# EAGLE design Zoetrope (EAGLE 8.6.0)
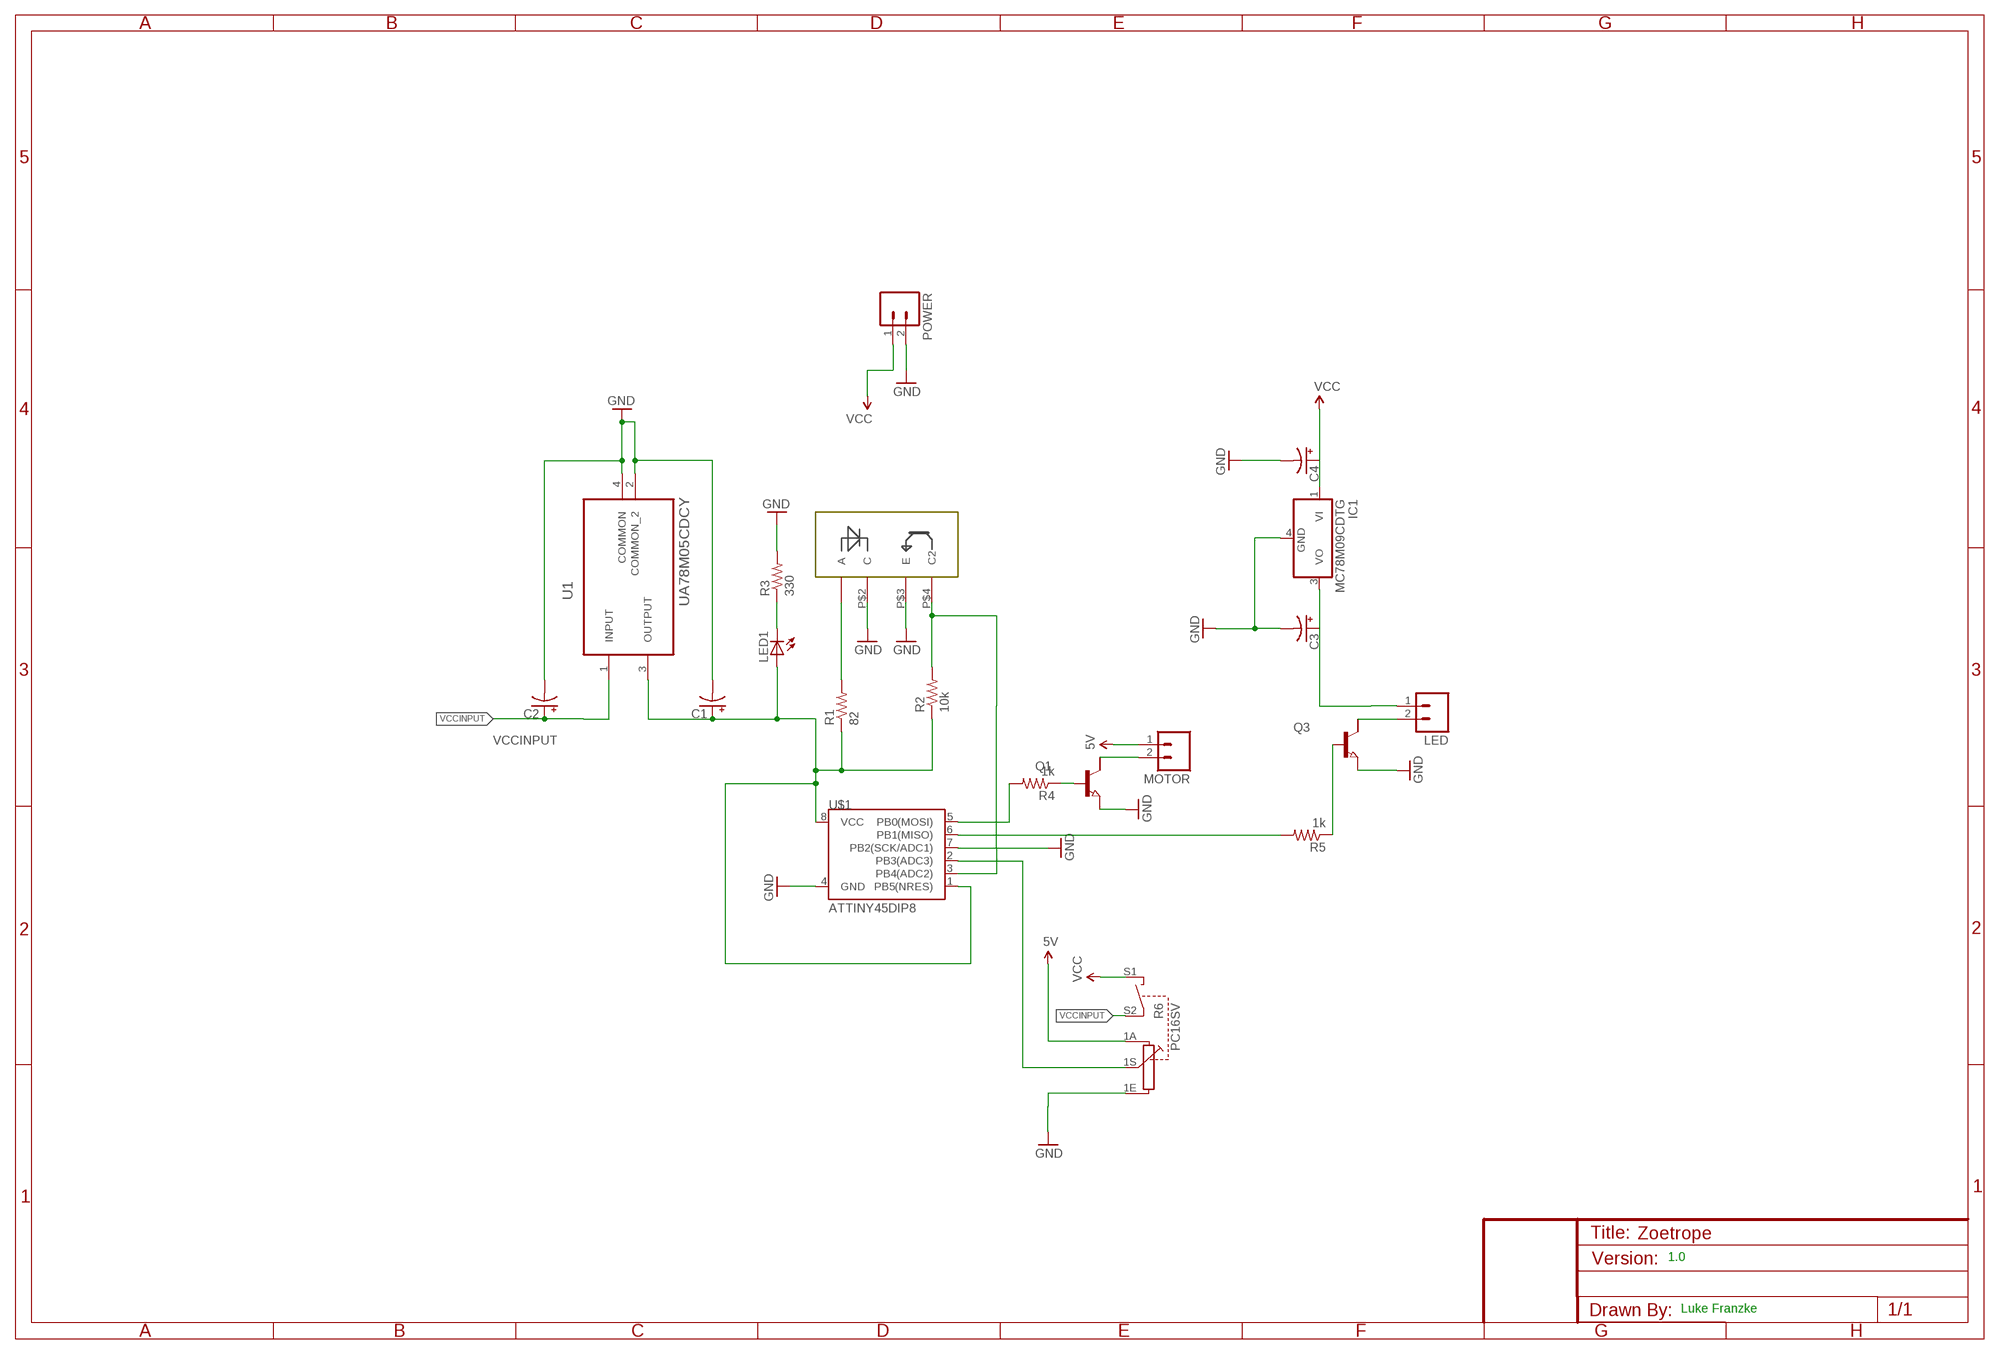
[diagram p0: schematic, sheet 1]

## Parts
C1  CAP_POL1206  [EIA3216]
C2  CAP_POL1206  [EIA3216]
C3  CAP_POL1206  [EIA3216]
C4  CAP_POL1206  [EIA3216]
IC1  MC78M09CDTG  [DPACK_3]
LED  M02  [02P]
LED1  LED1206  [LED-1206]
MOTOR  M02  [02P]
POWER  M02  [02P]
Q1  NPN-TRANSISTIOR-2COLSOT89  [SOT89]
Q3  NPN-TRANSISTIOR-2COLSOT89  [SOT89]
R1  82  RESISTOR1206  [1206]
R2  10k  RESISTOR1206  [1206]
R3  330  RESISTOR1206  [1206]
R4  1k  RESISTOR1206  [1206]
R5  1k  RESISTOR1206  [1206]
R6  PC16SV  [PC16SV]
U1  UA78M05CDCY  [SOT230P700X180-4N]
U$1  ATTINY45DIP8  [DIP08]
U$2  TCRT1000  [TCRT1000]

## Nets
5V: C1.A(+) LED1.A MOTOR.1 R1.1 R2.1 R6.1A U1.3(OUTPUT) U$1.1(PB5(NRES)) U$1.8(VCC)
GND: C1.C(-) C2.C(-) C3.C(-) C4.C(-) IC1.4(GND) POWER.2 Q1.3(E) Q3.3(E) R3.2 R6.1E U1.2(COMMON_2) U1.4(COMMON) U$1.4(GND) U$1.7(PB2(SCK/ADC1)) U$2.P$2(C) U$2.P$3(E)
N$1: R5.2 U$1.6(PB1(MISO))
N$2: LED1.C R3.1
N$3: LED.2 Q3.2(C)
N$4: R1.2 U$2.P$1(A)
N$5: R2.2 U$1.3(PB4(ADC2)) U$2.P$4(C2)
N$6: R6.1S U$1.2(PB3(ADC3))
N$7: Q3.1(B) R5.1
N$8: Q1.1(B) R4.1
N$9: R4.2 U$1.5(PB0(MOSI))
N$10: MOTOR.2 Q1.2(C)
N$12: C3.A(+) IC1.3(VO) LED.1
VCC: C4.A(+) IC1.1(VI) POWER.1 R6.S1
VCCINPUT: C2.A(+) R6.S2 U1.1(INPUT)
Unconnected: Q1.2@1(C/) Q3.2@1(C/)

## Notes on the sheet
- 1.0
- Luke Franzke

## Library data of the parts
C1-C4 = RP400N501A:CAP_POL: Capacitor Polarized These are standard SMD and PTH capacitors. Normally 10uF, 47uF, and 100uF in electrolytic and tantalum varieties. Always verify the external diameter of the through hole cap, it varies with capacity, voltage, and manufacturer. The EIA devices should be standard.
IC1 = linear:MC78M: 500 mA Positive Voltage Regulators Source: Data sheet <http://www.onsemi.com/pub_link/Collateral/MC78M00-D.PDF>
LED MOTOR POWER = con-amp-quick:M02: AMP QUICK CONNECTOR; OC_FARNELL: unknown; OC_NEWARK: unknown
LED1 = SparkFun:LED: LEDs Standard schematic elements and footprints for 5mm, 3mm, 1206, and 0603 sized LEDs. 5mm - Spark Fun Electronics SKU : COM-00529 (and others)
Q1 Q3 = semicon-smd-ipc:NPN-TRANSISTIOR-2COL: NPN TRANSISTOR 2 colletor pins
R1-R5 = SparkFun:RESISTOR: Resistor Basic schematic elements and footprints for 0603, 1206, and PTH 1/10th watt (small) resistors.
R6 = piher:PC16SV: POTENTIOMETER vertical single carbon potentiometer with switch, 16 mm; OC_FARNELL: unknown; OC_NEWARK: unknown
U1 = Texas Instruments_By_element14_Batch_1:UA78M05CDCY: IC, LINEAR VOLT REGULATOR, 5V; MPN: UA78M05CDCY; OC_FARNELL: 1575761; OC_NEWARK: 77C1885; PACKAGE: SOT-223-3; SUPPLIER: TEXAS INSTRUMENTS
U$1 = SparkFun:ATTINY45: Atmel ATTiny45
U$2 = TCRT1000:TCRT1000

## Board
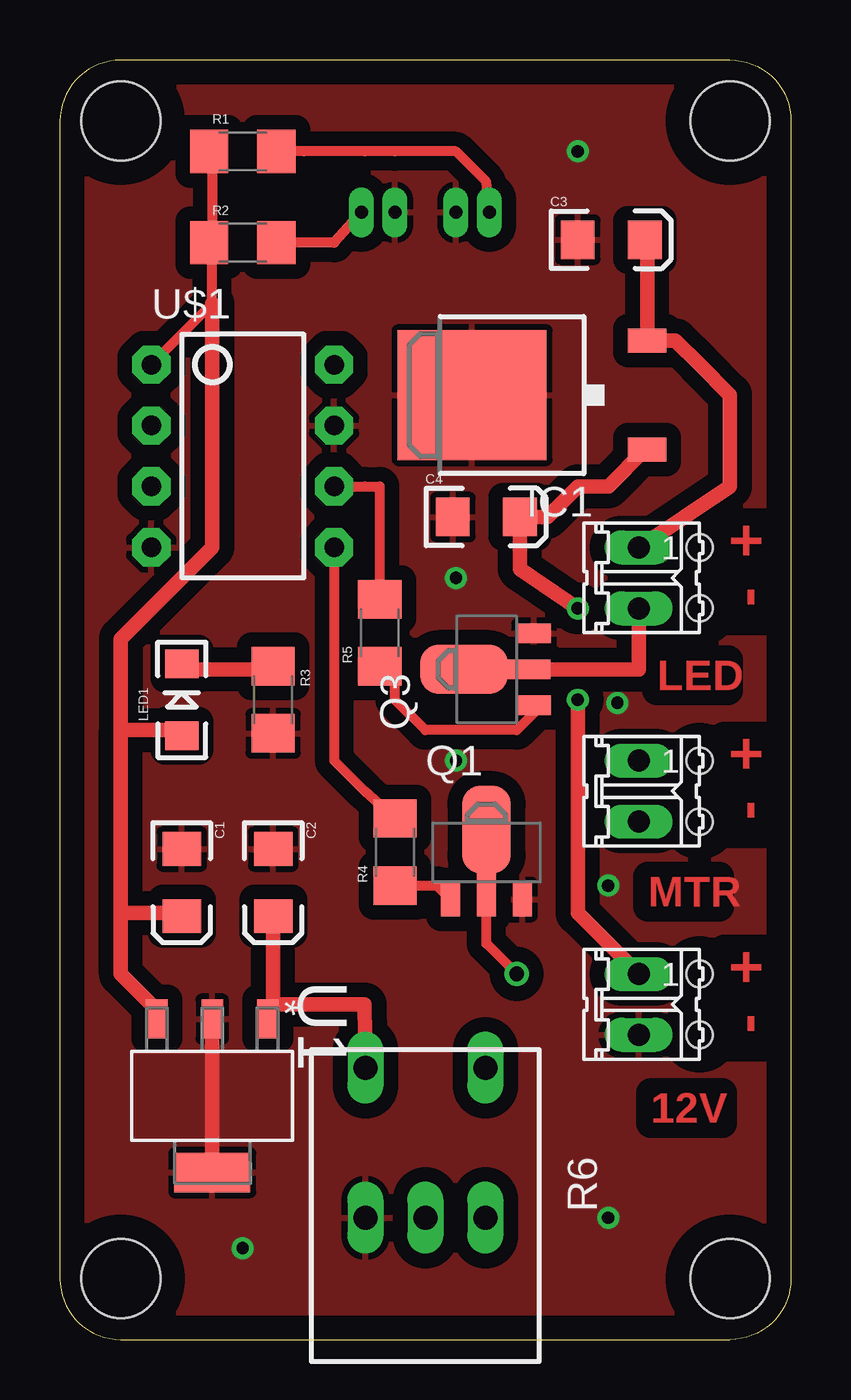
[diagram p1: board, top side]
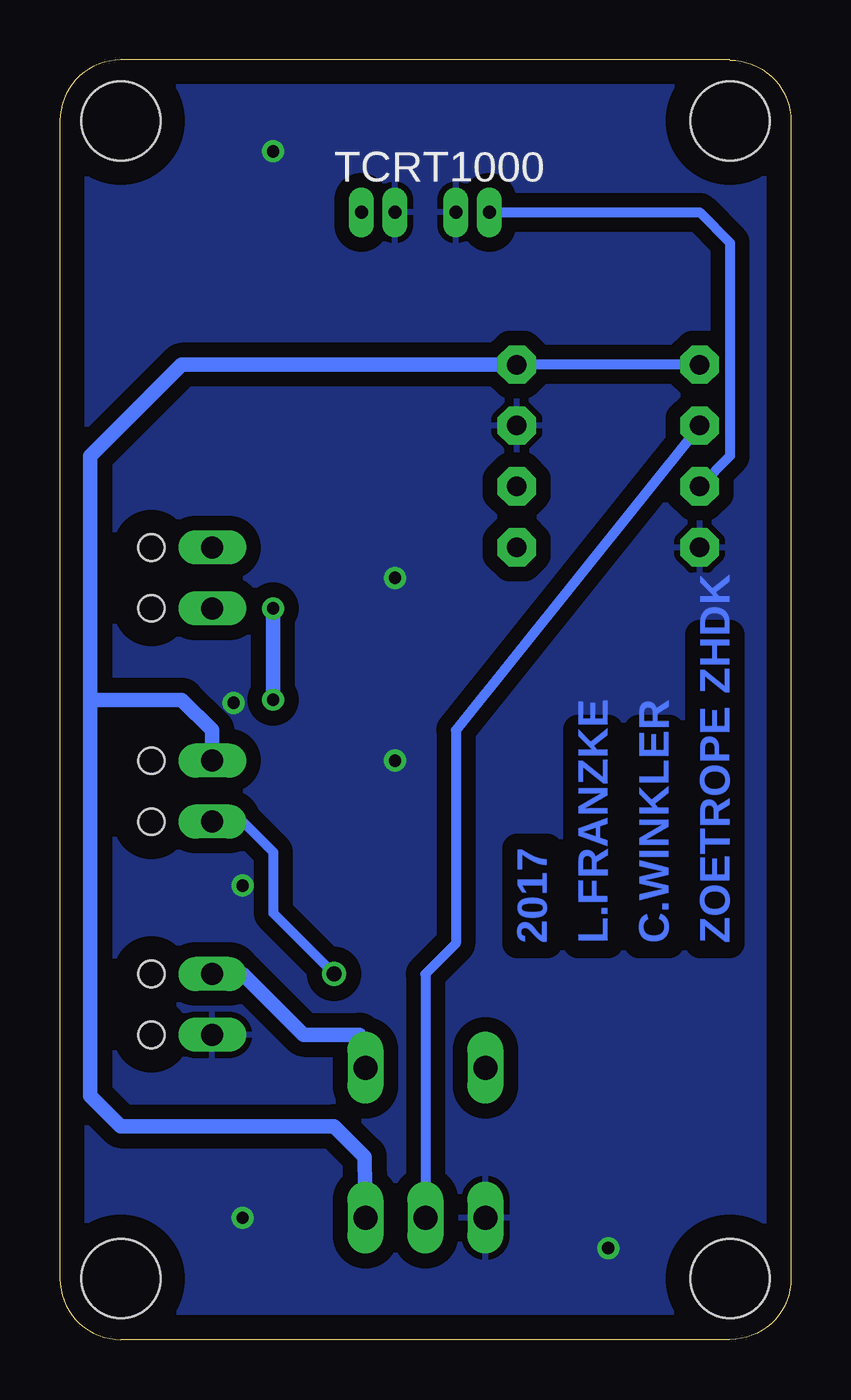
[diagram p2: board, bottom side, seen from below]

Size 30.48 x 53.34 mm. Coordinates in mm from the lower left corner, seen from the top.
Outline: 2.54,53.33 arc90 0,50.79 0,2.54 arc90 2.54,0 27.94,0 arc90 30.48,2.54 30.48,50.8 arc90 27.94,53.34 2.54,53.34
Copper layers (1*16): Top 0.035mm / dielectric 1.5mm / Bottom 0.035mm
Design rules "default": minimum track width 10mil, minimum drill 24mil, track to track 8mil, track to pad 8mil, pad to pad 8mil, via to via 8mil, smd to smd 8mil, copper to edge 40mil, drill to drill 8mil, minimum pad ring 10mil, minimum via ring 8mil, stop-mask expansion 4mil, vias tented up to drill 0mil, thermal gap 10mil

### Footprints (pad centres in the part's own frame; a part is rotated, then mirrored left to right if it is on the bottom)
EIA3216 = smd 1.4 x 1.6: A 1.4,0; C -1.4,0
DPACK_3 = smd 1 x 1.6: 1 -2.28,-4.8; 3 2.28,-4.8 | smd 5.4 x 6.2: 4 0,2.5
02P = drill 0.914 long: 1 -1.27,0; 2 1.27,0 | hole 1.1: -1.27,2.54; 1.27,2.54
LED-1206 = smd 1.2 x 1.4: A -1.5,0; C 1.5,0
SOT89 = smd 0.8 x 1.4: 1 -1.499,-1.981; 3 1.499,-1.981 | smd 0.8 x 1.9: 2 0,-1.727 | smd 2.032 x 3.65: 2@1 0,0.94
1206 = smd 1.6 x 1.8: 1 -1.4,0; 2 1.4,0
PC16SV = drill 1 long: 1A -2.5,0; 1E 2.5,0; 1S 0,0; S1 -2.5,-6.25; S2 2.5,-6.25
SOT230P700X180-4N = smd 1.626 x 0.889: 1 -3.2,2.311; 2 -3.2,0; 3 -3.2,-2.311 | smd 1.626 x 3.175: 4 3.2,0
DIP08 = drill 0.813 pad 1.6 octagon: 1 -3.81,-3.81; 2 -1.27,-3.81; 3 1.27,-3.81; 4 3.81,-3.81; 5 3.81,3.81; 6 1.27,3.81; 7 -1.27,3.81; 8 -3.81,3.81
TCRT1000 = drill 0.533 long: P$1 -2.667,0; P$2 -1.27,0; P$3 1.27,0; P$4 2.667,0
STAND-OFF = hole 3.302: 0,0

### Placement (x,y rotation side)
C1  5.08,19.05 270 top
C2  8.89,19.05 270 top
C3  22.99,45.85 0 top
C4  17.78,34.29 0 top
IC1  19.68,39.37 90 top
LED  24.13,31.75 270 top
LED1  5.08,26.67 90 top
MOTOR  24.13,22.86 270 top
POWER  24.13,13.97 270 top
Q1  17.78,20.32 0 top
Q3  17.78,27.94 90 top
R1  7.62,49.53 0 top
R2  7.62,45.72 0 top
R3  8.89,26.67 270 top
R4  13.97,20.32 90 top
R5  13.34,29.46 90 top
R6  15.24,5.08 180 top
U1  6.35,10.16 270 top
U$1  7.62,36.83 270 top
U$2  15.24,46.99 0 bottom
U$4  [STAND-OFF]  2.54,50.8 0 top
U$5  [STAND-OFF]  27.94,50.8 0 top
U$6  [STAND-OFF]  2.54,2.54 0 top
U$7  [STAND-OFF]  27.94,2.54 0 top

### Tracks (layer width: path | path; a pad name or v marks a point on that pad's centre or on a via)
5V
  Top 0.254: 5.08,25.4 LED1.A | 3.81,13.97 U1.3 | 5.08,17.78 C1.A | 6.35,49.53 R1.1 | 6.35,45.72 R2.1 6.35,45.72
  Top 0.406: 6.35,49.53 6.35,45.72 6.35,43.18 U$1.1
  Top 0.61: 2.54,25.4 5.08,25.4 | 2.54,17.78 2.54,15.24 3.81,13.97 | 2.54,17.78 2.54,25.4 | 2.54,17.78 5.08,17.78 | 2.54,25.4 2.54,29.21 6.35,33.02 6.35,43.18
  Bottom 0.406: U$1.1 U$1.8
  Bottom 0.61: 29.21,26.67 29.21,10.16 27.94,8.89 19.05,8.89 17.78,7.62 R6.1A | MOTOR.1 24.13,25.4 25.4,26.67 29.21,26.67 | U$1.8 25.4,40.64 29.21,36.83 29.21,26.67
GND  (via drill 0.51)
  Top 0.61: U1.2 U1.4
  other vias: 16.51,24.13 22.86,5.08 21.59,49.53 7.62,3.81 16.51,31.75 23.24,26.54 22.86,18.92
  pour Top (isolate 0.61): 31.75,-1.27 31.75,54.61 -1.27,54.61 -1.27,-1.27
  pour Bottom (isolate 0.61): 33.02,-2.54 33.02,55.88 -2.54,55.88 -2.54,-2.54
N$1
  Top 0.406: R5.2 13.34,35.56 12.7,35.56 U$1.6
N$2
  Top 0.254: 5.08,27.94 LED1.C | 8.89,27.94 R3.1
  Top 0.61: 8.89,27.94 5.08,27.94
N$3
  Top 0.61: Q3.2 24.13,27.94 24.13,29.21 LED.2
N$4
  Top 0.254: R1.2 10.16,49.53 R1.2
  Top 0.406: R1.2 10.16,49.53 12.7,49.53 13.97,49.53 16.51,49.53 17.78,48.26 U$2.P$1
N$5
  Top 0.254: R2.2 8.89,45.72 R2.2
  Top 0.406: R2.2 11.43,45.72 U$2.P$4
  Bottom 0.406: U$1.3 2.54,36.83 2.54,45.72 3.81,46.99 5.08,46.99 U$2.P$4
N$6
  Bottom 0.406: U$1.2 13.97,25.4 13.97,16.51 15.24,15.24 R6.1S
N$7
  Top 0.406: Q3.1 19.76,26.11 19.05,25.4 15.24,25.4 13.97,26.67 13.97,27.43 R5.1
N$8
  Top 0.406: R4.1 15.7,18.92 Q1.1
N$9
  Top 0.406: U$1.5 11.43,24.13 12.7,22.86 R4.2
N$10  (via drill 0.61)
  Top 0.406: v19.05,15.24 17.78,16.51 Q1.2
  Bottom 0.406: v19.05,15.24 21.59,17.78 21.59,20.32 22.86,21.59 MOTOR.2
N$12
  Top 0.61: LED.1 27.94,35.56 27.94,39.37 26.67,40.64 25.66,41.65 IC1.3 24.48,45.75 C3.A
VCC  (via drill 0.51)
  Top 0.61: POWER.1 21.59,17.78 v21.59,26.67 | v21.59,30.48 19.18,32.13 C4.A 20.32,34.29 21.59,35.56 22.86,35.56 24.39,37.09 IC1.1
  Bottom 0.61: POWER.1 22.86,15.24 20.32,12.7 17.98,12.7 arc45 R6.S1 | v21.59,26.67 v21.59,30.48
VCCINPUT
  Top 0.254: C2.A 8.89,17.78 C2.A
  Top 0.406: 8.89,13.97 U1.1
  Top 0.61: 8.89,13.97 C2.A | 8.89,13.97 U1.1 | 8.89,13.97 12.7,13.97 R6.S2

### Text on the board
Top: + | - | LED | + | - | MTR | + | - | 12V
Bottom: ZOETROPE ZHDK | C.WINKLER | L.FRANZKE | 2017
tStop: + | - | LED | + | - | MTR | + | - | 12V
bStop: ZOETROPE ZHDK | C.WINKLER | L.FRANZKE | 2017